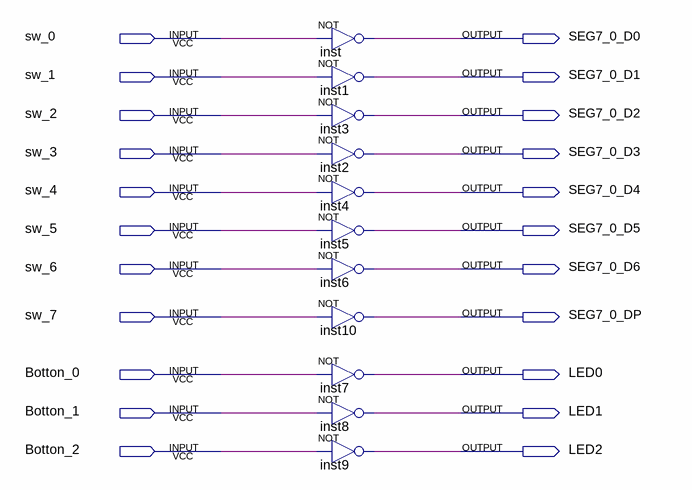
[diagram p0: schematic sheet]
// Quartus schematic FPGA_Project.bdf as structural Verilog: 11 symbols, 22 pins
module FPGA_Project (
  input  sw_0,
  input  sw_1,
  input  sw_2,
  input  sw_3,
  input  sw_4,
  input  sw_5,
  input  sw_6,
  input  sw_7,
  input  Botton_0,
  input  Botton_1,
  input  Botton_2,
  output SEG7_0_D0,
  output SEG7_0_D1,
  output SEG7_0_D2,
  output SEG7_0_D3,
  output SEG7_0_D4,
  output SEG7_0_D5,
  output SEG7_0_D6,
  output SEG7_0_DP,
  output LED0,
  output LED1,
  output LED2
);

  not inst (SEG7_0_D0, sw_0);
  not inst1 (SEG7_0_D1, sw_1);
  not inst3 (SEG7_0_D2, sw_2);
  not inst2 (SEG7_0_D3, sw_3);
  not inst4 (SEG7_0_D4, sw_4);
  not inst5 (SEG7_0_D5, sw_5);
  not inst6 (SEG7_0_D6, sw_6);
  not inst10 (SEG7_0_DP, sw_7);
  not inst7 (LED0, Botton_0);
  not inst8 (LED1, Botton_1);
  not inst9 (LED2, Botton_2);
endmodule
